# Altium schematic sheet SLAYER_Storage.SchDoc
size A; SheetNumber: 4; SheetTotal: 4
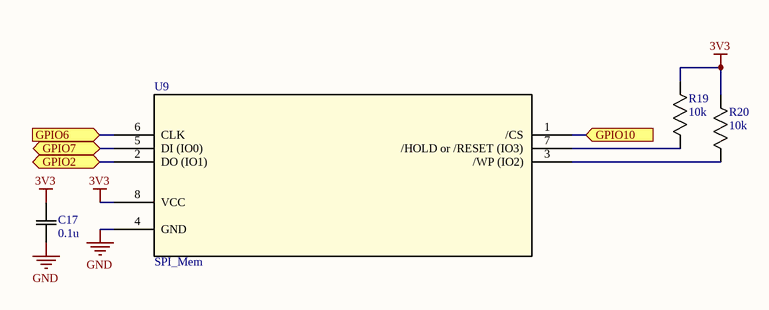
[diagram p0: SLAYER_Storage.SchDoc]

## Parts
C17  0.1u  [0.1uF/50V]
R19  10k  [10k/0.125W]
R20  10k  [10k/0.125W]
U9  SPI_Mem  [SPI_Memory/1Mb]

## Ports
GPIO2 (bidir, see SLAYER_ESP32_M1U[3A]), GPIO6 (in, see SLAYER_ESP32_M1U[3B]), GPIO7 (bidir, see SLAYER_ESP32_M1U[3B]), GPIO10 (in, see SLAYER_ESP32_M1U[3B])

## Nets
3V3: C17.2 R19.1 R20.1 U9.8(VCC)
GND: C17.1 U9.4(GND)
GPIO2: U9.2(DO_(IO1)) ; port GPIO2
GPIO6: U9.6(CLK) ; port GPIO6
GPIO7: U9.5(DI_(IO0)) ; port GPIO7
GPIO10: U9.1(/CS) ; port GPIO10
NetR19_2: R19.2 U9.7(/HOLD_or_/RESET_(IO3))
NetR20_2: R20.2 U9.3(/WP_(IO2))

## Library data of the parts
C17 = 0.1uF/50V: CC0603KRX7R9BB104; Manufacturer_Name: Yageo; Copyright: Copyright (C) 2025 Ultra Librarian. All rights reserved.; Manufacturer_Part_Number: CC0603KRX7R9BB104
R19 R20 = 10k/0.125W: CRCW060310K0FKEA; Manufacturer_Name: Vishay; Copyright: Copyright (C) 2025 Ultra Librarian. All rights reserved.; Manufacturer_Part_Number: CRCW060310K0FKEA
U9 = SPI_Memory/1Mb: W25Q128JVSIQ; Manufacturer_Name: Winbond; Copyright: Copyright (C) 2026 Ultra Librarian. All rights reserved.; Manufacturer_Part_Number: W25Q128JVSIQ; RefDes: RefDes; Type: Type